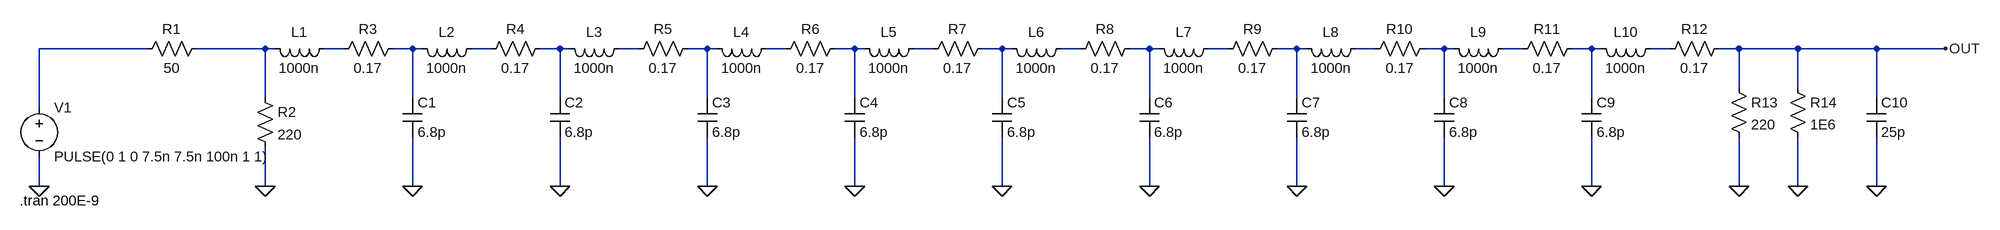
[diagram p0: schematic 10 cell_L.asc]
10 cell_L.asc, the LTspice schematic file:
Version 4
SHEET 1 1636 776
WIRE -1360 0 -1536 0
WIRE -1168 0 -1280 0
WIRE -1152 0 -1168 0
WIRE -1040 0 -1072 0
WIRE -928 0 -960 0
WIRE -912 0 -928 0
WIRE -800 0 -832 0
WIRE -688 0 -720 0
WIRE -672 0 -688 0
WIRE -560 0 -592 0
WIRE -448 0 -480 0
WIRE -432 0 -448 0
WIRE -320 0 -352 0
WIRE -208 0 -240 0
WIRE -192 0 -208 0
WIRE -80 0 -112 0
WIRE 32 0 0 0
WIRE 48 0 32 0
WIRE 160 0 128 0
WIRE 272 0 240 0
WIRE 288 0 272 0
WIRE 400 0 368 0
WIRE 512 0 480 0
WIRE 528 0 512 0
WIRE 640 0 608 0
WIRE 752 0 720 0
WIRE 768 0 752 0
WIRE 880 0 848 0
WIRE 992 0 960 0
WIRE 1008 0 992 0
WIRE 1120 0 1088 0
WIRE 1232 0 1200 0
WIRE 1328 0 1232 0
WIRE 1456 0 1328 0
WIRE 1568 0 1456 0
WIRE 1232 64 1232 0
WIRE 1328 64 1328 0
WIRE -1168 80 -1168 0
WIRE -928 80 -928 0
WIRE -688 80 -688 0
WIRE -448 80 -448 0
WIRE -208 80 -208 0
WIRE 32 80 32 0
WIRE 272 80 272 0
WIRE 512 80 512 0
WIRE 752 80 752 0
WIRE 992 80 992 0
WIRE 1456 80 1456 0
WIRE -1536 96 -1536 0
WIRE -1536 224 -1536 176
WIRE -1168 224 -1168 160
WIRE -928 224 -928 144
WIRE -688 224 -688 144
WIRE -448 224 -448 144
WIRE -208 224 -208 144
WIRE 32 224 32 144
WIRE 272 224 272 144
WIRE 512 224 512 144
WIRE 752 224 752 144
WIRE 992 224 992 144
WIRE 1232 224 1232 144
WIRE 1328 224 1328 144
WIRE 1456 224 1456 144
FLAG -1536 224 0
FLAG -1168 224 0
FLAG -928 224 0
FLAG -688 224 0
FLAG -448 224 0
FLAG -208 224 0
FLAG 32 224 0
FLAG 272 224 0
FLAG 512 224 0
FLAG 752 224 0
FLAG 992 224 0
FLAG 1232 224 0
FLAG 1328 224 0
FLAG 1456 224 0
FLAG 1568 0 OUT
SYMBOL voltage -1536 80 R0
WINDOW 123 0 0 Left 0
WINDOW 39 0 0 Left 0
SYMATTR InstName V1
SYMATTR Value PULSE(0 1 0 7.5n 7.5n 100n 1 1)
SYMBOL res -1264 -16 R90
WINDOW 0 0 56 VBottom 2
WINDOW 3 32 56 VTop 2
SYMATTR InstName R1
SYMATTR Value 50
SYMBOL res -1184 64 R0
SYMATTR InstName R2
SYMATTR Value 220
SYMBOL ind -1056 -16 R90
WINDOW 0 5 56 VBottom 2
WINDOW 3 32 56 VTop 2
SYMATTR InstName L1
SYMATTR Value 1000n
SYMBOL res -944 -16 R90
WINDOW 0 0 56 VBottom 2
WINDOW 3 32 56 VTop 2
SYMATTR InstName R3
SYMATTR Value 0.17
SYMBOL cap -944 80 R0
SYMATTR InstName C1
SYMATTR Value 6.8p
SYMBOL ind -816 -16 R90
WINDOW 0 5 56 VBottom 2
WINDOW 3 32 56 VTop 2
SYMATTR InstName L2
SYMATTR Value 1000n
SYMBOL res -704 -16 R90
WINDOW 0 0 56 VBottom 2
WINDOW 3 32 56 VTop 2
SYMATTR InstName R4
SYMATTR Value 0.17
SYMBOL cap -704 80 R0
SYMATTR InstName C2
SYMATTR Value 6.8p
SYMBOL ind -576 -16 R90
WINDOW 0 5 56 VBottom 2
WINDOW 3 32 56 VTop 2
SYMATTR InstName L3
SYMATTR Value 1000n
SYMBOL res -464 -16 R90
WINDOW 0 0 56 VBottom 2
WINDOW 3 32 56 VTop 2
SYMATTR InstName R5
SYMATTR Value 0.17
SYMBOL cap -464 80 R0
SYMATTR InstName C3
SYMATTR Value 6.8p
SYMBOL ind -336 -16 R90
WINDOW 0 5 56 VBottom 2
WINDOW 3 32 56 VTop 2
SYMATTR InstName L4
SYMATTR Value 1000n
SYMBOL res -224 -16 R90
WINDOW 0 0 56 VBottom 2
WINDOW 3 32 56 VTop 2
SYMATTR InstName R6
SYMATTR Value 0.17
SYMBOL cap -224 80 R0
SYMATTR InstName C4
SYMATTR Value 6.8p
SYMBOL ind -96 -16 R90
WINDOW 0 5 56 VBottom 2
WINDOW 3 32 56 VTop 2
SYMATTR InstName L5
SYMATTR Value 1000n
SYMBOL res 16 -16 R90
WINDOW 0 0 56 VBottom 2
WINDOW 3 32 56 VTop 2
SYMATTR InstName R7
SYMATTR Value 0.17
SYMBOL cap 16 80 R0
SYMATTR InstName C5
SYMATTR Value 6.8p
SYMBOL ind 144 -16 R90
WINDOW 0 5 56 VBottom 2
WINDOW 3 32 56 VTop 2
SYMATTR InstName L6
SYMATTR Value 1000n
SYMBOL res 256 -16 R90
WINDOW 0 0 56 VBottom 2
WINDOW 3 32 56 VTop 2
SYMATTR InstName R8
SYMATTR Value 0.17
SYMBOL cap 256 80 R0
SYMATTR InstName C6
SYMATTR Value 6.8p
SYMBOL ind 384 -16 R90
WINDOW 0 5 56 VBottom 2
WINDOW 3 32 56 VTop 2
SYMATTR InstName L7
SYMATTR Value 1000n
SYMBOL res 496 -16 R90
WINDOW 0 0 56 VBottom 2
WINDOW 3 32 56 VTop 2
SYMATTR InstName R9
SYMATTR Value 0.17
SYMBOL cap 496 80 R0
SYMATTR InstName C7
SYMATTR Value 6.8p
SYMBOL ind 624 -16 R90
WINDOW 0 5 56 VBottom 2
WINDOW 3 32 56 VTop 2
SYMATTR InstName L8
SYMATTR Value 1000n
SYMBOL res 736 -16 R90
WINDOW 0 0 56 VBottom 2
WINDOW 3 32 56 VTop 2
SYMATTR InstName R10
SYMATTR Value 0.17
SYMBOL cap 736 80 R0
SYMATTR InstName C8
SYMATTR Value 6.8p
SYMBOL ind 864 -16 R90
WINDOW 0 5 56 VBottom 2
WINDOW 3 32 56 VTop 2
SYMATTR InstName L9
SYMATTR Value 1000n
SYMBOL res 976 -16 R90
WINDOW 0 0 56 VBottom 2
WINDOW 3 32 56 VTop 2
SYMATTR InstName R11
SYMATTR Value 0.17
SYMBOL cap 976 80 R0
SYMATTR InstName C9
SYMATTR Value 6.8p
SYMBOL ind 1104 -16 R90
WINDOW 0 5 56 VBottom 2
WINDOW 3 32 56 VTop 2
SYMATTR InstName L10
SYMATTR Value 1000n
SYMBOL res 1216 -16 R90
WINDOW 0 0 56 VBottom 2
WINDOW 3 32 56 VTop 2
SYMATTR InstName R12
SYMATTR Value 0.17
SYMBOL res 1216 48 R0
SYMATTR InstName R13
SYMATTR Value 220
SYMBOL res 1312 48 R0
SYMATTR InstName R14
SYMATTR Value 1E6
SYMBOL cap 1440 80 R0
SYMATTR InstName C10
SYMATTR Value 25p
TEXT -1568 248 Left 2 !.tran 200E-9

The netlist it stands for:
* 10 cell_L.asc
V1 N001 0 PULSE(0 1 0 7.5n 7.5n 100n 1 1)
R1 N002 N001 50
R2 N002 0 220
L1 N003 N002 1000n
R3 N004 N003 0.17
C1 N004 0 6.8p
L2 N005 N004 1000n
R4 N006 N005 0.17
C2 N006 0 6.8p
L3 N007 N006 1000n
R5 N008 N007 0.17
C3 N008 0 6.8p
L4 N009 N008 1000n
R6 N010 N009 0.17
C4 N010 0 6.8p
L5 N011 N010 1000n
R7 N012 N011 0.17
C5 N012 0 6.8p
L6 N013 N012 1000n
R8 N014 N013 0.17
C6 N014 0 6.8p
L7 N015 N014 1000n
R9 N016 N015 0.17
C7 N016 0 6.8p
L8 N017 N016 1000n
R10 N018 N017 0.17
C8 N018 0 6.8p
L9 N019 N018 1000n
R11 N020 N019 0.17
C9 N020 0 6.8p
L10 N021 N020 1000n
R12 OUT N021 0.17
R13 OUT 0 220
R14 OUT 0 1E6
C10 OUT 0 25p
.tran 200E-9
.backanno
.end